# EAGLE schematic driver (EAGLE 9.6.2)

## Sheet 1 of 2
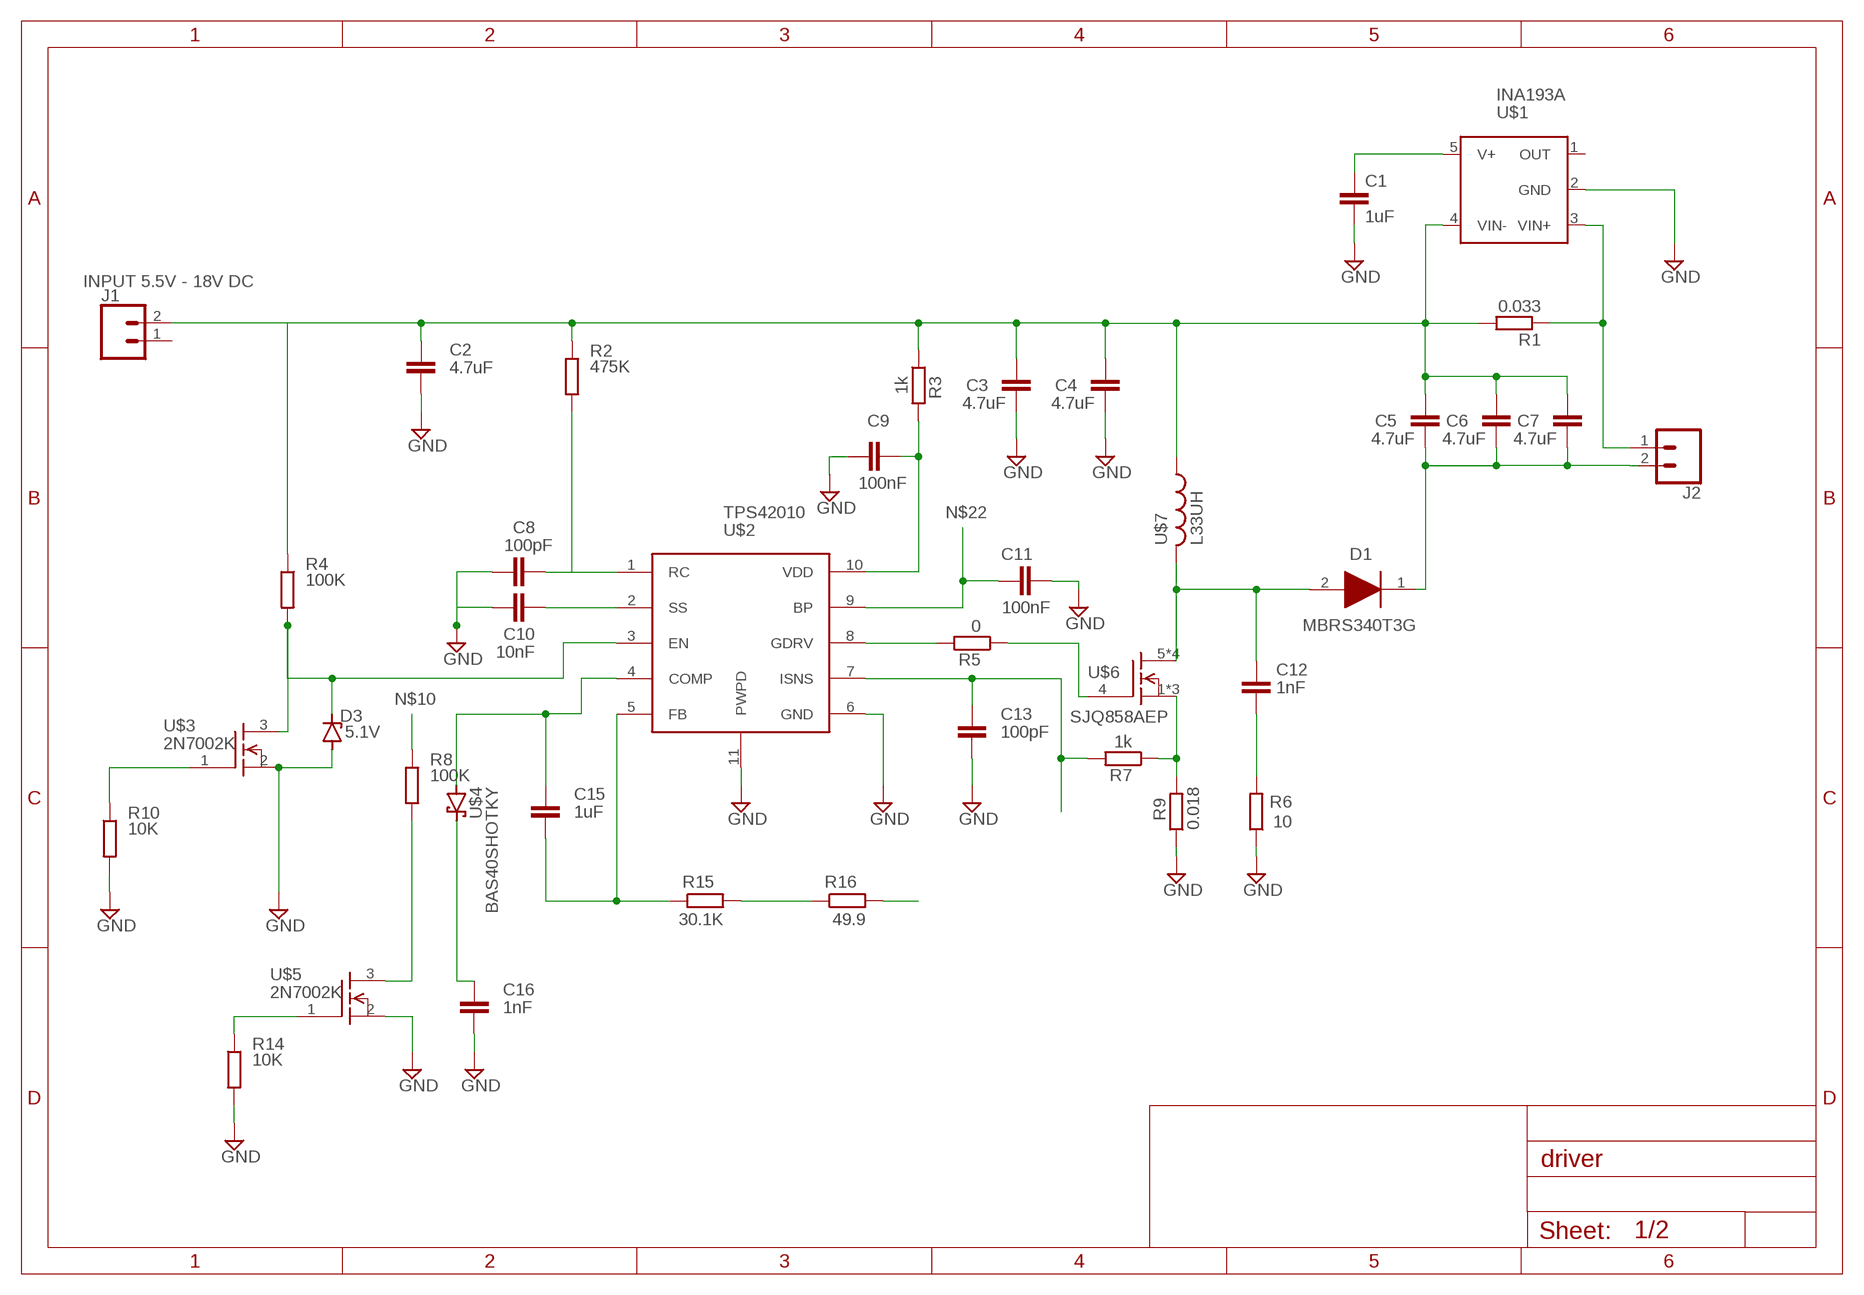
[diagram p0: schematic, sheet 1]

### Parts
C1  1uF  C-EUC0603  [C0603]
C2  4.7uF  C-EUC0603  [C0603]
C3  4.7uF  C-EUC0603  [C0603]
C4  4.7uF  C-EUC0603  [C0603]
C5  4.7uF  C-EUC0603  [C0603]
C6  4.7uF  C-EUC0603  [C0603]
C7  4.7uF  C-EUC0603  [C0603]
C8  100pF  C-EUC0603  [C0603]
C9  100nF  C-EUC0603  [C0603]
C10  10nF  C-EUC0603  [C0603]
C11  100nF  C-EUC0603  [C0603]
C12  1nF  C-EUC0603  [C0603]
C13  100pF  C-EUC0603  [C0603]
C15  1uF  C-EUC0603  [C0603]
C16  1nF  C-EUC0603  [C0603]
D1  MBRS340T3G  [DIOM8059X261N]
D3  5.1V  ZENER-DIODESOT23  [SOT23]
J1  CONN_02PTH4  [1X02_XTRA_BIG]
J2  CONN_02PTH4  [1X02_XTRA_BIG]
R1  0.033  R-EU_R0603  [R0603]
R2  475K  R-EU_R0603  [R0603]
R3  1k  R-EU_R0603  [R0603]
R4  100K  R-EU_R0603  [R0603]
R5  0  R-EU_R0603  [R0603]
R6  10  R-EU_R1206  [R1206]
R7  1k  R-EU_R0603  [R0603]
R8  100K  R-EU_R0603  [R0603]
R9  0.018  R-EU_R1206  [R1206]
R10  10K  R-EU_R0603  [R0603]
R14  10K  R-EU_R0603  [R0603]
R15  30.1K  R-EU_R0603  [R0603]
R16  49.9  R-EU_R0603  [R0603]
U$1  INA193A  [SOT95P280X145-5N]
U$2  TPS42010  [SOP50P490X110-11N]
U$3  2N7002K  [SOT95P237X112-3N]
U$4  BAS40SHOTKY  [SOT323-3]
U$5  2N7002K  [SOT95P237X112-3N]
U$6  SJQ858AEP  [SQJ858AEPT1_GE3]
U$7  L33UH  [L33UH]

### Nets
GND: C1.2 C2.2 C3.2 C4.2 C8.1 C9.2 C10.1 C11.2 C13.2 C16.2 D3.1(A) R6.1 R9.1 R10.2 R14.2 U$1.2(GND) U$2.6(GND) U$2.11(PWPD) U$3.2(S) U$5.2(S)
N$1: C2.1 C3.1 C4.1 C5.1 C6.1 C7.1 J1.2 R1.2 R2.1 R3.1 R4.1 U$1.4(VIN-) U$7.P$1
N$2: C1.1 U$1.5(V+)
N$3: C5.2 C6.2 C7.2 D1.1(K) J2.2
N$4: J2.1 R1.1 U$1.3(VIN+)
N$5: C8.2 R2.2 U$2.1(RC)
N$6: C10.2 U$2.2(SS)
N$7: R10.1 U$3.1(G)
N$8: D3.3(C) R4.2 U$2.3(EN) U$3.3(D)
N$9: C15.1 U$2.4(COMP) U$4.P$1(A)
N$10: R8.1
N$11: R8.2 U$5.3(D)
N$12: R14.1 U$5.1(G)
N$13: C16.1 U$4.P$3(C)
N$14: C13.1 R7.2 U$2.7(ISNS)
N$15: R5.2 U$2.8(GDRV)
N$16: R5.1 U$6.4(G)
N$17: R7.1 R9.2 U$6.1(S) U$6.2(S) U$6.3(S)
N$18: C15.2 R15.1 U$2.5(FB)
N$19: C9.1 R3.2 U$2.10(VDD)
N$20: R15.2 R16.1
N$21: R16.2
N$22: C11.1 U$2.9(BP)
N$23: C12.2 D1.2(A) U$6.5(D) U$6.6(D) U$6.7(D) U$6.8(D) U$7.P$2
N$24: C12.1 R6.2
Unconnected: J1.1 U$1.1(OUT)

### Notes on the sheet
- INPUT 5.5V - 18V DC

## Sheet 2 of 2
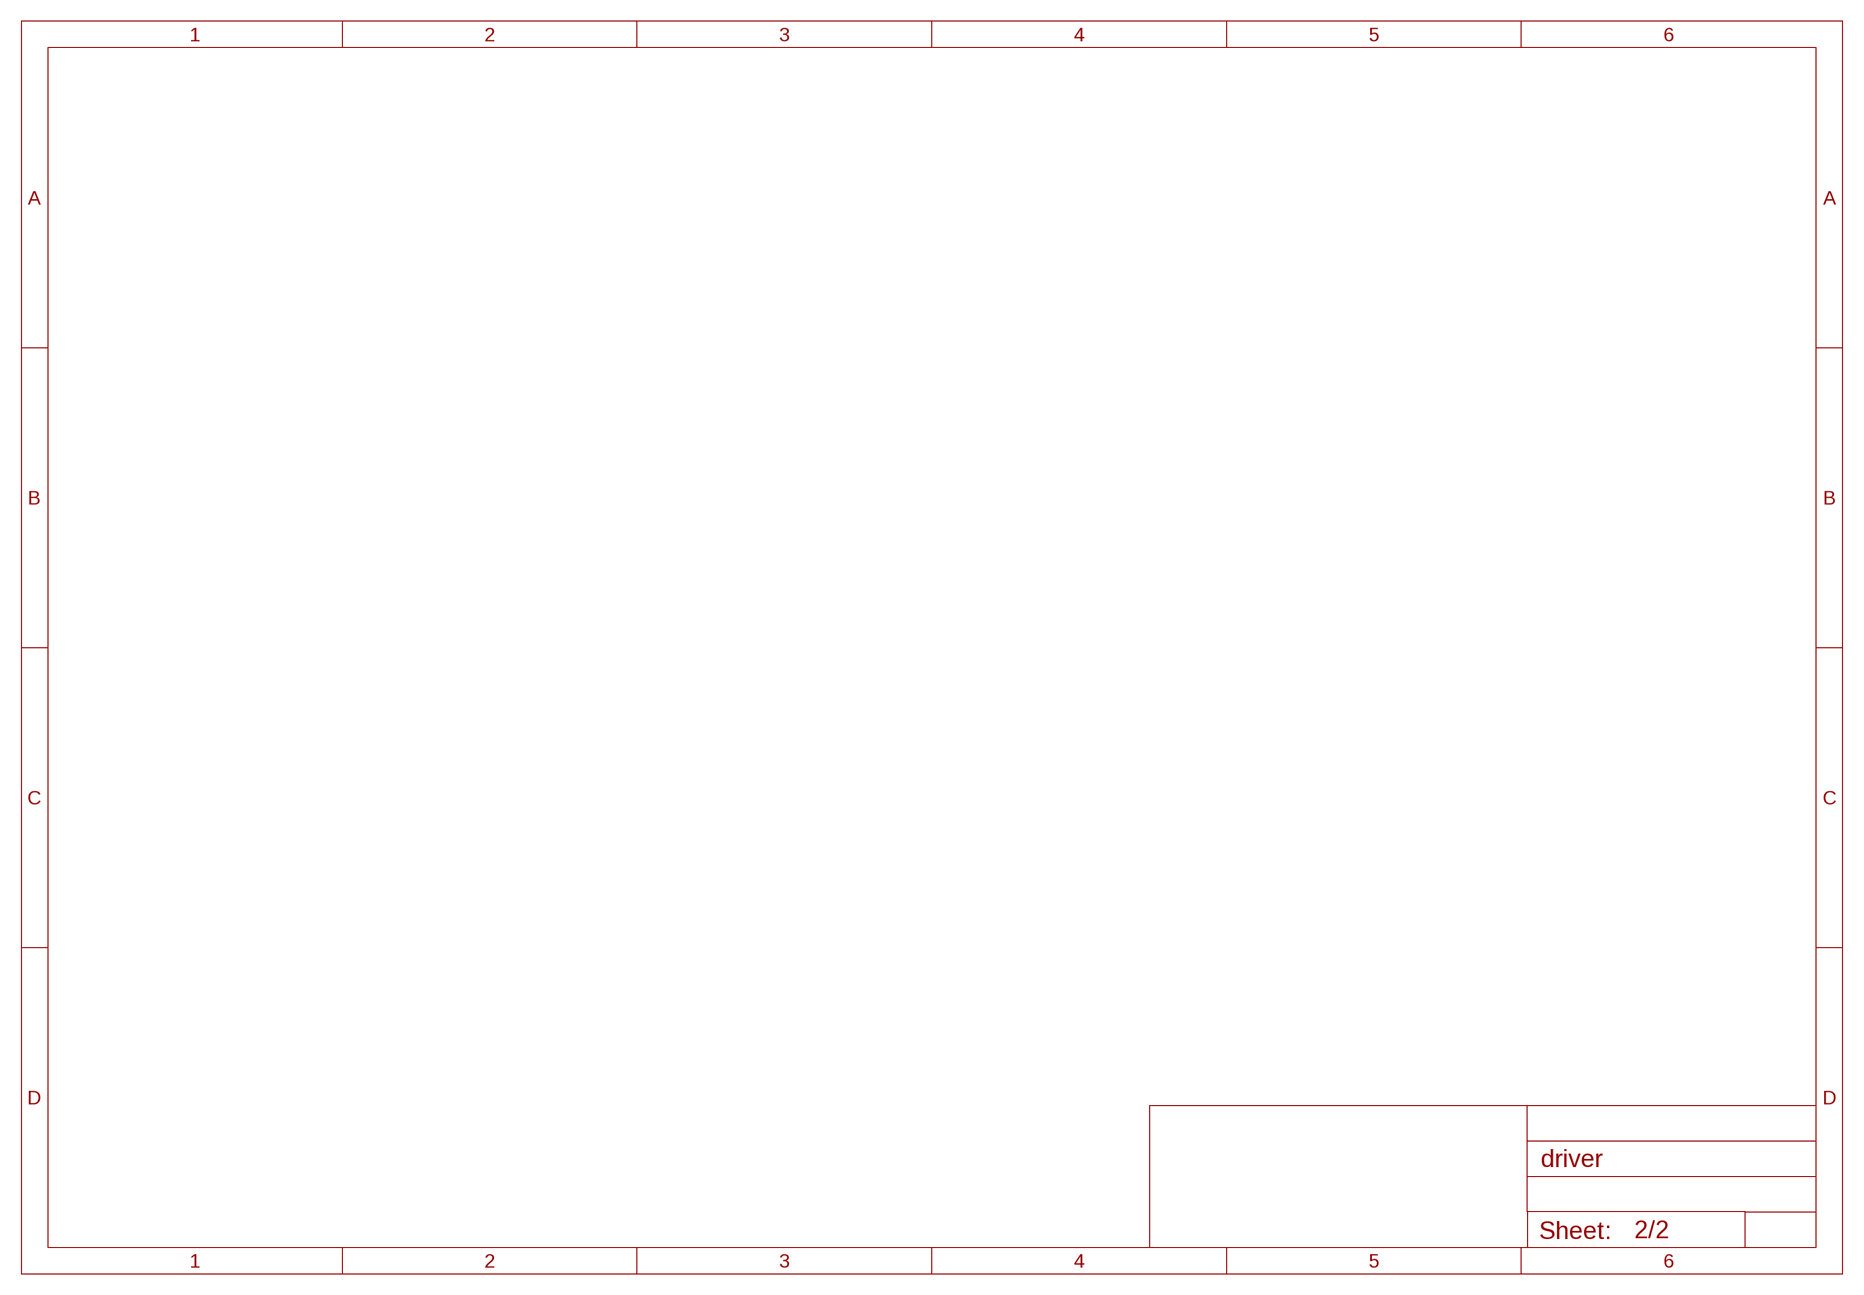
[diagram p1: schematic, sheet 2]

## Library data of the parts
C1-C13 C15 C16 = rcl:C-EU: CAPACITOR, European symbol; SPICEPREFIX: C
D1 = SamacSys_Parts:MBRS340T3G: MBRS340T3G, Schottky Diode, 4A max, 40V, 2-Pin, SMC Source: Datasheet <http://www.onsemi.com/pub/Collateral/MBRS340T3-D.PDF>; DESCRIPTION: MBRS340T3G, Schottky Diode, 4A max, 40V, 2-Pin, SMC; HEIGHT: 2.61mm; MANUFACTURER_NAME: ON Semiconductor; MANUFACTURER_PART_NUMBER: MBRS340T3G; MOUSER_PART_NUMBER: 863-MBRS340T3G; MOUSER_PRICE-STOCK: https://www.mouser.co.uk/ProductDetail/ON-Semiconductor/MBRS340T3G?qs=3JMERSakeboCr3wxBgfY3w%3D%3D
D3 = diode:ZENER-DIODE: Z-Diode
J1 J2 = stijnvdbUSB:CONN_02: Multi connection point. Often used as Generic Header-pin footprint for 0.1 inch spaced/style header connections On any of the 0.1 inch spaced packages, you can populate with these: Break Away Headers - Straight <https://www.sparkfun.com/products/116> (PRT-00116) Break Away Male Headers - Right Angle <https://www.sparkfun.com/products/553> (PRT-00553) Female Headers <https://www.sparkfun.com/products/115> (PRT-00115) Break Away Headers - Machine Pin <https://www.sparkfun.com/products/117> (PRT-00117) Break Away Female Headers - Swiss Machine Pin <https://www.sparkfun.com/products/743> (PRT-00743) For SCREWTERMINALS and SPRING TERMINALS visit here: Screw Terimnals on SparkFun.com <https://www.sparkfun.com/search/results?term=Screw+Terminals> (5mm/3.5mm/2.54mm spacing) This device is also useful as a general connection point to wire up your design to another part of your project. Our various solder wires solder well into these plated through hole pads. Hook-Up Wire - Assortment (Stranded, 22 AWG) <https://www.sparkfun.com/products/11375> (PRT-11375) Hook-Up Wire - Assortment (Solid Core, 22 AWG) <https://www.sparkfun.com/products/11367> (PRT-11367) View the entire wire category on our website here <https://www.sparkfun.com/categories/141> Special notes: Molex polarized connector foot print use with: PRT-08233 with associated crimp pins and housings. 2.54_SCREWTERM for use with PRT-10571. 3.5mm Screw Terminal footprints for PRT-08084 5mm Screw Terminal footprints for use with PRT-08432
R1-R10 R14-R16 = rcl:R-EU_: RESISTOR, European symbol; SPICEPREFIX: R
U$1 = SamacSys_Parts:INA193A
U$2 = SamacSys_Parts:TPS42010
U$3 U$5 = SamacSys_Parts:2N7002K
U$4 = SamacSys_Parts:BAS40SHOTKY
U$6 = SamacSys_Parts:SJQ858AEP
U$7 = SamacSys_Parts:L33UH